# Altium schematic sheet USB-to-Serial Converter.SchDoc: USB to Serial Converter
size A4; Date: Dec. 28th, 2022; Author: Karl Asseily; DrawnBy: Karl Asseily; DocumentNumber: 202301140903; Revision: 1.2; SheetNumber: 9; SheetTotal: 20; Time: 10:23
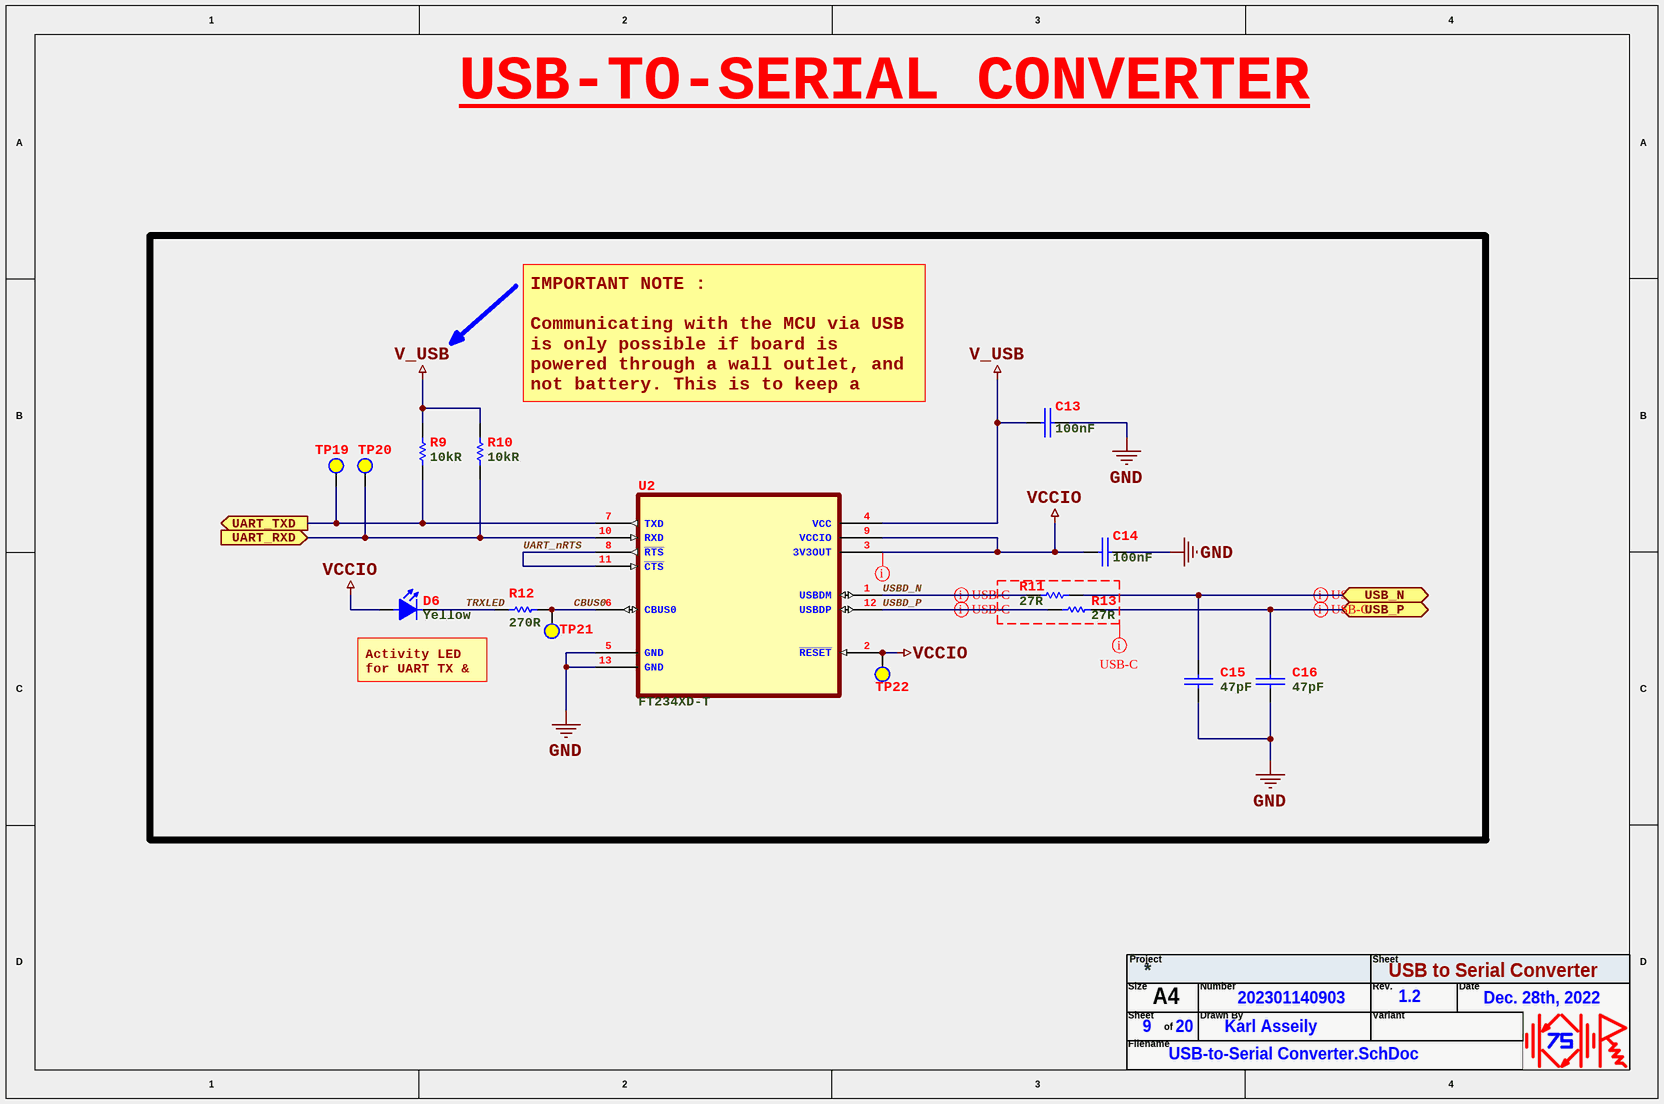
[diagram p0: USB-to-Serial Converter.SchDoc]

## Parts
C13  100nF  [CAP_0603]
C14  100nF  [CAP_0603]
C15  47pF  [CAP_0603]
C16  47pF  [CAP_0603]
D6  Yellow  [LED_YLW_0603]
R9  10kR  [RES_0603]
R10  10kR  [RES_0603]
R11  27R  [RES_0603]
R12  270R  [RES_0603]
R13  27R  [RES_0603]
TP19  UART_TXD  [TEST POINT HOLE]  (value not drawn)  (no BOM)
TP20  UART_RXD  [TEST POINT HOLE]  (value not drawn)  (no BOM)
TP21  CBUS0  [TEST POINT HOLE]  (value not drawn)  (no BOM)
TP22  VCCIO  [TEST POINT HOLE]  (value not drawn)  (no BOM)
U2  FT234XD-T  [IC_SON45P300X300X80-13N]

## Ports
UART_RXD (in, see Cellar Watchdog, ESP32 Processor, Main Controller Unit), UART_TXD (out, see Cellar Watchdog, ESP32 Processor, Main Controller Unit), USB_N (bidir, see Cellar Watchdog, Power Delivery, USB-C Connector), USB_P (bidir, see Cellar Watchdog, Power Delivery, USB-C Connector)

## Nets
GND: C13.2 C14.2 C15.2 C16.2 U2.5(GND) U2.13(GND)
V_USB: C13.1 R9.2 R10.2 U2.4(VCC)
VCCIO: C14.1 D6.1(A) TP22.TP U2.2(~{RESET}) U2.3(3V3OUT) U2.9(VCCIO)
CBUS0: R12.2 TP21.TP U2.6(CBUS0)
TRXLED: D6.2(K) R12.1
UART_nRTS: U2.8(~{RTS}) U2.11(~{CTS})
UART_RXD: R10.1 TP20.TP U2.10(RXD) ; port UART_RXD
UART_TXD: R9.1 TP19.TP U2.7(TXD) ; port UART_TXD
USB_N: C15.1 R11.2 ; port USB_N
USB_P: C16.1 R13.2 ; port USB_P
USBD_N: R11.1 U2.1(USBDM)
USBD_P: R13.1 U2.12(USBDP)

## Layout directives
net class USB-C; rule Impedance Constraint [Min = 89.10    Max = 90.90    ]; rule Matched Net Lengths [Delay Tolerance = 5ps]; rule Length Constraint [Min Length = 0mil    Max Length = 3000mil]: (no net found under the mark)
differential pair; differential pair class USB: USB_N, USB_P, USBD_N, USBD_P
net class POWER; rule Supply Nets [Voltage = 3.300]: VCCIO

## Notes on the sheet
- USB-TO-SERIAL CONVERTER
- (near R10) IMPORTANT NOTE :
  Communicating with the MCU via USB is only possible if board is powered through a wall outlet, and not battery. This is to keep a constant 5V supply to the IC.
- Activity LED for UART TX & RX
- Project
- Sheet
- Size
- Filename
- A4
- of
- Number
- Drawn By
- Rev.
- Variant
- Date

## Library data of the parts
C13 C14 = CAP_0.1uF-50V-10%_0603: 0.1 µF ±10% 50V Ceramic Capacitor X7R 0603 (1608 Metric); Manufacturer: Yageo; Manufacturer Part Number: CC0603KRX7R9BB104; Supplier 1: Digi-Key; RoHS: Yes; Category: Ceramic Capacitors; Stock 1: 10054527; Pricing 1: 1=0.10000, 10=0.05400, 50=0.02960, 100=0.02430, 500=0.01732, 1000=0.01361 (USD); Mounting Technology: Surface Mount; Case/Package: 0603; Pins: 2; Case Code (Metric): 1608; Case Code (Imperial): 0603; Dielectric Material: Ceramic; Min Operating Temperature: -55°C; Max Operating Temperature: 125°C; Package Quantity: 1; Capacitance: 100nF; Voltage Rating: 50V; Tolerance: 10%; Packaging: Tape and Reel; Dielectric: X7R; Termination: SMD/SMT; Voltage: 50V; Series: CC; Length: 0.063inch; Width: 0.031inch; Height: 0.8mm; Thickness: 0.035inch; Depth: 0.8mm; Radiation Hardening: No; Reach SVHC Compliant: Yes; Lead Free: Lead Free; Halogen Free: Halogen Free; RoHS Compliant: Yes; ComponentLink1URL: C:\Users\Public\Documents\Altium\Projects\Cellar_Watchdog\Docs\Capacitor\UPY-GPHC_X7R_6.3V-to-250V_22.pdf; ComponentLink1Description: Datasheet; Supplier Part Number 2: 603-CC603KRX7R9BB104; Supplier Part Number 1: 311-1344-1-ND; Supplier 2: Mouser
C15 C16 = CAP_47pf-50V-5%_0603: 47 pF ±5% 50V Ceramic Capacitor C0G, NP0 0603 (1608 Metric); Manufacturer: Yageo Phycomp; Manufacturer Part Number: CC0603JRNPO9BN470; Insulation Resistance: 100GR; Temperature Coefficient: 30ppm/°C; Supplier 1: Digi-Key; RoHS: Yes; Category: Ceramic Capacitors; Stock 1: 855841; Pricing 1: 1=0.10000, 10=0.03500, 50=0.01920, 100=0.01570, 500=0.01120, 1000=0.00880 (USD); Mounting Technology: Surface Mount; Case/Package: 0603; Pins: 2; Case Code (Imperial): 0603; Case Code (Metric): 1608; Min Operating Temperature: -55°C; Max Operating Temperature: 125°C; Tolerance: 5%; Capacitance: 47pF; Dielectric: C0G; Voltage Rating: 50V; Packaging: Tape and Reel; Voltage Rating (DC): 50V; Voltage: 50V; Package Quantity: 1; Termination: SMD/SMT; Resistor Type: Ceramic; Series: CC; Length: 1.6mm; Width: 0.8mm; Height: 0.8mm; Thickness: 0.035inch; Depth: 0.8mm; Radiation Hardening: No; Lead Free: Lead Free; RoHS Compliant: Yes; Reach SVHC Compliant: Yes; ComponentLink1URL: C:\Users\Public\Documents\Altium\Projects\Cellar_Watchdog\Docs\Capacitor\UPY-GP_NP0_16V-to-50V_18.pdf; ComponentLink1Description: Datasheet; Supplier 2: Mouser; Supplier Part Number 1: 311-1065-1-ND; Supplier Part Number 2: 603-CC603JRNPO9BN470
D6 = LED_YLW-2.1V-30mA_0603: Yellow 591nm LED Indication - Discrete 2.1V 0603 (1608 Metric); Manufacturer: Vishay Lite-On; Manufacturer Part Number: LTST-C191KSKT; Lens Color: Colorless; Viewing Angle: 130°; Lens Style: Diffused,Colorless,Rectangular,Clear; Luminous Intensity: 180mcd; Forward Current: 30mA; Forward Voltage: 2.4V; Power Rating: 75mW; Dominant Wavelength: 597nm; Test Current: 20mA; Lens Transparency: Clear; Number of Elements: 1; Wavelength: 588nm; Reverse Voltage: 5V; Supplier 1: Digi-Key; RoHS: Yes; Category: LEDs; Stock 1: 1434021; Pricing 1: 1=0.28000, 10=0.15000, 100=0.06990, 500=0.06450, 1000=0.05052, 2000=0.04945 (USD); Mounting Technology: Surface Mount; Case/Package: 0603; Pins: 2; Color: Yellow; Case Code (Metric): 1608; Case Code (Imperial): 0603; Min Operating Temperature: -55°C; Max Operating Temperature: 85°C; Package Quantity: 1; Packaging: Tape and Reel; Illumination Color: Yellow; Power Dissipation: 75mW; Number of LEDs: 1; Length: 1.6mm; Width: 0.8mm; Height: 0.55mm; Depth: 0.8mm; Radiation Hardening: No; RoHS Compliant: Yes; Lead Free: Lead Free; ComponentLink1URL: C:\Users\Public\Documents\Altium\Projects\Cellar_Watchdog\Docs\LED\LTST-C191KSKT.PDF; ComponentLink1Description: Datasheet; Supplier 2: Mouser; Supplier Part Number 1: 160-1448-1-ND; Supplier Part Number 2: 859-LTST-C191KSKT
R9 R10 = RES_10kR-100mW-1%_0603: 10 kOhms ±1% 0.1W, 1/10W Chip Resistor 0603 (1608 Metric) Moisture Resistant Thick Film; Manufacturer: Yageo; Manufacturer Part Number: RC0603FR-0710KL; Temperature Coefficient: 100ppm/°C; Voltage Rating (DC): 50V; Power Rating: 100mW; Voltage Rating: 75V; Supplier 1: Digi-Key; RoHS: Yes; Category: Chip SMD Resistors; Stock 1: 43209622; Pricing 1: 1=0.10000, 10=0.02100, 100=0.00850, 1000=0.00383, 2500=0.00332 (USD); Case/Package: 0603; Pins: 2; Case Code (Imperial): 0603; Case Code (Metric): 1608; Weight: 7.1E-05oz; Min Operating Temperature: -55°C; Max Operating Temperature: 155°C; Tolerance: 1%; Resistor Type: Thick Film; Resistance: 10kR; Packaging: Tape and Reel; Termination: SMD/SMT; Features: Moisture Resistant; Series: RC; Max Power Dissipation: 100mW; Number of Terminations: 2; Resistance Tolerance: 1%; Construction: Rectangular; Length: 1.6mm; Width: 0.8mm; Height: 0.45mm; Depth: 0.8mm; Lead Pitch: 0.3mm; Reach SVHC Compliant: Yes; Lead Free: Lead Free; Military Standard: Not; RoHS Compliant: Yes; ComponentLink6URL: C:\Users\Public\Documents\Altium\Projects\Cellar_Watchdog\Docs\Resistor\PYu-RC_Group_51_RoHS_L_12.pdf; ComponentLink6Description: Datasheet; Supplier 2: Mouser; Supplier Part Number 1: 311-10.0KHRCT-ND; Supplier Part Number 2: 603-RC0603FR-0710KL
R11 R13 = RES_27R-100mW-1%_0603: 27 Ohms ±1% 0.1W, 1/10W Chip Resistor 0603 (1608 Metric) Moisture Resistant Thick Film; Manufacturer: Yageo; Manufacturer Part Number: RC0603FR-0727RL; Voltage Rating (DC): 50V; Temperature Coefficient: 100ppm/°C; Power Rating: 100mW; Supplier 1: Digi-Key; RoHS: Yes; Category: Chip SMD Resistors; Stock 1: 815867; Pricing 1: 1=0.10000, 10=0.02100, 100=0.00850, 1000=0.00383, 2500=0.00332 (USD); Case/Package: 0603; Pins: 2; Case Code (Metric): 1608; Case Code (Imperial): 0603; Min Operating Temperature: -55°C; Max Operating Temperature: 155°C; Resistance: 27R; Tolerance: 1%; Packaging: Tape and Reel; Resistor Type: Thick Film; Number of Terminations: 2; Voltage Rating: 50V; Package Quantity: 1; Termination: SMD/SMT; Max Power Dissipation: 100mW; Features: Moisture Resistant; Series: RC; Resistance Tolerance: 1%; Length: 0.063inch; Width: 0.8mm; Height: 0.022inch; Depth: 0.8mm; Lead Free: Lead Free; RoHS Compliant: Yes; Supplier 2: Mouser; Supplier Part Number 1: 311-27.0HRCT-ND; Supplier Part Number 2: 603-RC0603FR-0727RL; ComponentLink1Description: Datasheet; ComponentLink1URL: C:\Users\Public\Documents\Altium\Projects\Cellar_Watchdog\Docs\Resistor\PYu-RC_Group_51_RoHS_L_12.pdf
R12 = RES_270R-100mW-1%_0603: 270 Ohms ±1% 0.1W, 1/10W Chip Resistor 0603 (1608 Metric) Moisture Resistant Thick Film; Manufacturer: Yageo; Manufacturer Part Number: RC0603FR-07270RL; Power Rating: 100mW; Voltage Rating: 50V; Temperature Coefficient: 100ppm/°C; Supplier 1: Digi-Key; RoHS: Yes; Category: Chip SMD Resistors; Stock 1: 697012; Pricing 1: 1=0.10000, 10=0.02100, 100=0.00850, 1000=0.00383, 2500=0.00332 (USD); Case/Package: 0603; Pins: 2; Case Code (Imperial): 0603; Case Code (Metric): 1608; Min Operating Temperature: -55°C; Max Operating Temperature: 155°C; Resistance: 270R; Tolerance: 1%; Packaging: Tape and Reel; Voltage Rating (DC): 50V; Package Quantity: 5000; Termination: SMD/SMT; Resistor Type: Thick Film; Number of Terminations: 2; Max Power Dissipation: 100mW; Features: Moisture Resistant; Series: RC; Resistance Tolerance: 1%; Technology: THICK FILM; Construction: Rectangular; Length: 0.063inch; Width: 0.031inch; Height: 0.022inch; Depth: 0.8mm; RoHS Compliant: Yes; Military Standard: Not; Lead Free: Lead Free; ComponentLink1URL: C:\Users\Public\Documents\Altium\Projects\Cellar_Watchdog\Docs\Resistor\PYu-RC_Group_51_RoHS_L_12.pdf; ComponentLink1Description: Datasheet; Supplier 2: Mouser; Supplier Part Number 2: 603-RC0603FR-07270RL; Supplier Part Number 1: 311-270HRCT-ND
TP19-TP22 = Test Point: PCB Test Point; ClassName: Test Point
  TP19: Value: UART_TXD
  TP20: Value: UART_RXD
  TP21: Value: CBUS0
  TP22: Value: VCCIO
U2 = IC_FT234XD-T: USB Bridge, USB to UART USB 2.0 UART Interface 12-DFN (3x3); Manufacturer: FTDI; Number of Channels: 1; Operating Supply Voltage: 5.25V; Max Supply Voltage: 5.5V; Min Supply Voltage: 2.97V; Interface: USB,UART; Data Rate: 480Mbps; Operating Supply Current: 8mA; Supplier 1: Digi-Key; Manufacturer Part Number: FT234XD-T; RoHS: Yes; Category: Uncategorized; Stock 1: 30920; Pricing 1: 1=2.26000, 25=2.19000, 100=2.12000, 250=1.93000, 500=1.76250 (USD); Mount: Surface Mount; Case/Package: DFN; Number of Pins: 12; Min Operating Temperature: -40°C; Max Operating Temperature: 85°C; Packaging: Tray; Package Quantity: 490; ComponentLink2URL: C:\Users\Public\Documents\Altium\Projects\Cellar_Watchdog\Docs\USB-Serial Converter\DS_FT234XD.pdf; ComponentLink2Description: Datasheet; Supplier 2: Mouser; Supplier Part Number 1: 768-1345-ND; Supplier Part Number 2: 895-FT234XD-T; ComponentLink3Description: Design Guide (FT232BM); ComponentLink3URL: C:\Users\Public\Documents\Altium\Projects\Cellar_Watchdog\Docs\USB-Serial Converter\DG232_20.pdf; ComponentLink4Description: Technical Note USB Type-C; ComponentLink4URL: C:\Users\Public\Documents\Altium\Projects\Cellar_Watchdog\Docs\USB-Serial Converter\TN_181-Type-C-USB-Connectors-with-FTDI-Products.pdf